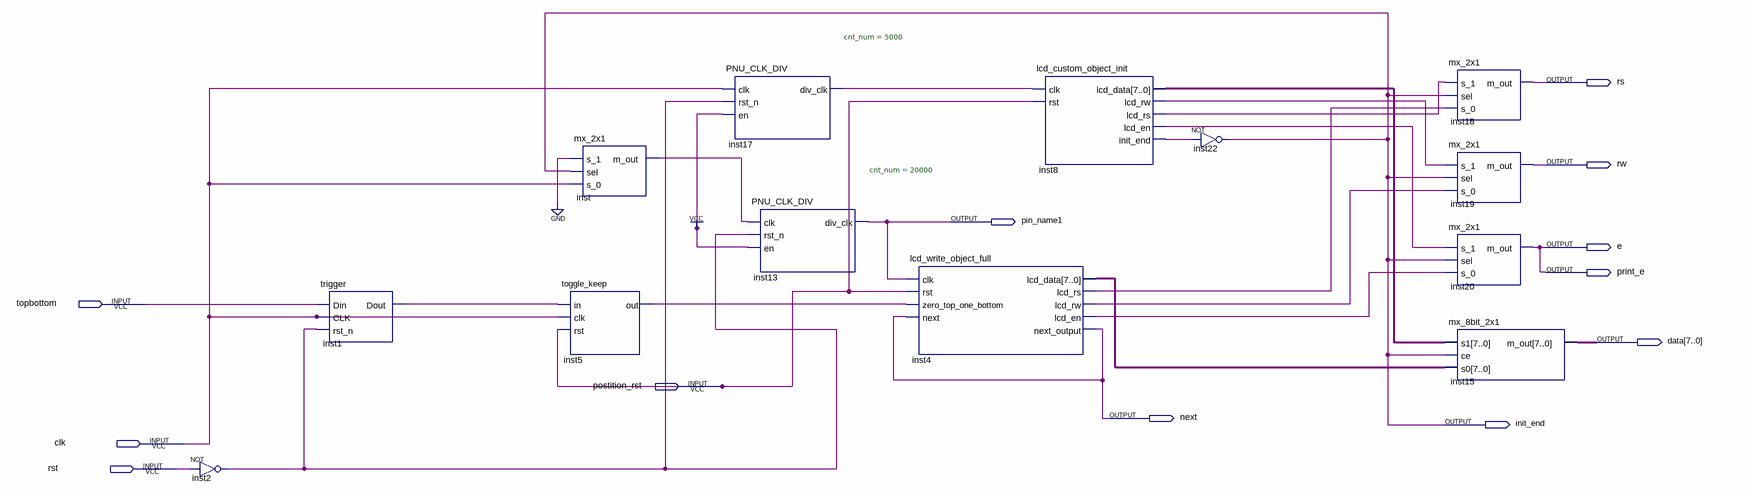
[diagram p0: schematic sheet]
// Quartus schematic test.bdf as structural Verilog: 13 symbols, 12 pins
module test (
  input  topbottom,
  input  postition_rst,
  input  clk,
  input  rst,
  output rs,
  output rw,
  output pin_name1,
  output e,
  output print_e,
  output [7:0] data,
  output next,
  output init_end
);

  wire inst1_dout, inst2_out, inst4_lcd_en, inst4_lcd_rs, inst4_lcd_rw, inst5_out, inst8_init_end,
       inst8_lcd_en, inst8_lcd_rs, inst8_lcd_rw, inst17_div_clk, inst_m_out;
  wire [7:0] inst4_lcd_data, inst8_lcd_data;

  not inst2 (inst2_out, rst);
  trigger inst1 (.Din(topbottom), .CLK(clk), .rst_n(inst2_out), .Dout(inst1_dout));
  mx_2x1 inst (.s_1(1'b0), .sel(init_end), .s_0(clk), .m_out(inst_m_out));
  toggle_keep inst5 (.in(inst1_dout), .clk(clk), .rst(postition_rst), .out(inst5_out));
  PNU_CLK_DIV #(.cnt_num(5000)) inst17 (.clk(clk), .rst_n(inst2_out), .en(1'b1), .div_clk(inst17_div_clk));
  PNU_CLK_DIV #(.cnt_num(20000)) inst13 (.clk(inst_m_out), .rst_n(inst2_out), .en(1'b1), .div_clk(pin_name1));
  lcd_write_object_full inst4 (
    .clk(pin_name1), .rst(postition_rst), .zero_top_one_bottom(inst5_out), .next(next),
    .lcd_data(inst4_lcd_data), .lcd_rs(inst4_lcd_rs), .lcd_rw(inst4_lcd_rw), .lcd_en(inst4_lcd_en),
    .next_output(next));
  lcd_custom_object_init inst8 (
    .clk(inst17_div_clk), .rst(postition_rst), .lcd_data(inst8_lcd_data), .lcd_rw(inst8_lcd_rw),
    .lcd_rs(inst8_lcd_rs), .lcd_en(inst8_lcd_en), .init_end(inst8_init_end));
  not inst22 (init_end, inst8_init_end);
  mx_2x1 inst18 (.s_1(inst8_lcd_rs), .sel(init_end), .s_0(inst4_lcd_rs), .m_out(rs));
  mx_2x1 inst19 (.s_1(inst8_lcd_rw), .sel(init_end), .s_0(inst4_lcd_rw), .m_out(rw));
  mx_2x1 inst20 (.s_1(inst8_lcd_en), .sel(init_end), .s_0(inst4_lcd_en), .m_out(e));
  mx_8bit_2x1 inst15 (.s1(inst8_lcd_data), .ce(init_end), .s0(inst4_lcd_data), .m_out(data));

  assign print_e = e;
endmodule
